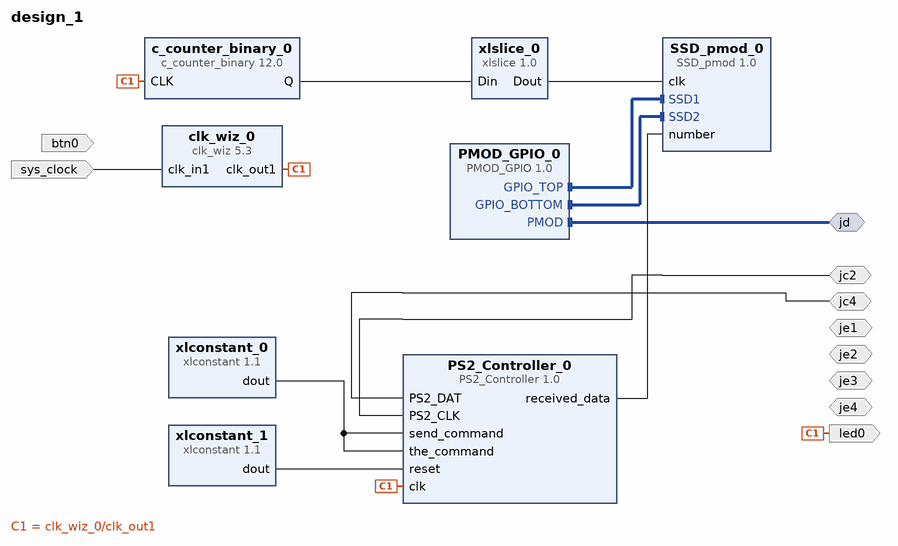
[diagram p0: block diagram of the top level]
# Vivado block design design_1, xc7z010clg400-1, Vivado 2016.4
create_bd_design design_1

create_bd_intf_port -mode Master -vlnv digilentinc.com:interface:pmod_rtl:1.0 jd
create_bd_port -dir IO je1
create_bd_port -dir IO je3
create_bd_port -dir I -type rst btn0
create_bd_port -dir IO je2
create_bd_port -dir IO je4
create_bd_port -dir I -type clk sys_clock
set_property -dict {CONFIG.FREQ_HZ 125000000 CONFIG.PHASE 0.000} [get_bd_ports sys_clock]
create_bd_port -dir O led0
create_bd_port -dir IO jc4
create_bd_port -dir IO jc2

create_bd_cell -type ip -vlnv xilinx.com:ip:clk_wiz:5.3 clk_wiz_0
set_property -dict [list \
  CONFIG.PRIMITIVE PLL \
  CONFIG.CLKOUT1_REQUESTED_OUT_FREQ 100.000 \
  CONFIG.CLKOUT1_DRIVES BUFG \
  CONFIG.CLKOUT2_DRIVES BUFG \
  CONFIG.CLKOUT3_DRIVES BUFG \
  CONFIG.CLKOUT4_DRIVES BUFG \
  CONFIG.CLKOUT5_DRIVES BUFG \
  CONFIG.CLKOUT6_DRIVES BUFG \
  CONFIG.CLKOUT7_DRIVES BUFG \
  CONFIG.FEEDBACK_SOURCE FDBK_AUTO \
  CONFIG.USE_RESET false \
  CONFIG.MMCM_DIVCLK_DIVIDE 5 \
  CONFIG.MMCM_CLKFBOUT_MULT_F 36 \
  CONFIG.MMCM_COMPENSATION ZHOLD \
  CONFIG.MMCM_CLKOUT0_DIVIDE_F 9 \
  CONFIG.USE_BOARD_FLOW true \
  CONFIG.CLK_IN1_BOARD_INTERFACE sys_clock \
  CONFIG.CLKOUT1_JITTER 237.312 \
  CONFIG.CLKOUT1_PHASE_ERROR 249.865 \
] [get_bd_cells clk_wiz_0]
create_bd_cell -type ip -vlnv skyroger2.com:user:PMOD_GPIO:1.0 PMOD_GPIO_0
create_bd_cell -type ip -vlnv xilinx.com:ip:xlconstant:1.1 xlconstant_0
set_property -dict {CONFIG.CONST_WIDTH 8 CONFIG.CONST_VAL 0} [get_bd_cells xlconstant_0]
create_bd_cell -type ip -vlnv skyroger2.com:user:SSD_pmod:1.0 SSD_pmod_0
create_bd_cell -type ip -vlnv xilinx.com:ip:c_counter_binary:12.0 c_counter_binary_0
set_property -dict {CONFIG.Output_Width 8} [get_bd_cells c_counter_binary_0]
create_bd_cell -type ip -vlnv xilinx.com:ip:xlslice:1.0 xlslice_0
set_property -dict {CONFIG.DOUT_WIDTH 1 CONFIG.DIN_TO 7 CONFIG.DIN_FROM 7 CONFIG.DIN_WIDTH 8} [get_bd_cells xlslice_0]
create_bd_cell -type ip -vlnv toronto.edu:user:PS2_Controller:1.0 PS2_Controller_0
set_property -dict {CONFIG.CLOCK 100} [get_bd_cells PS2_Controller_0]
create_bd_cell -type ip -vlnv xilinx.com:ip:xlconstant:1.1 xlconstant_1

# ---- connections ----

connect_bd_intf_net [get_bd_intf_pins SSD_pmod_0/SSD1] [get_bd_intf_pins PMOD_GPIO_0/GPIO_TOP]
connect_bd_intf_net [get_bd_intf_pins SSD_pmod_0/SSD2] [get_bd_intf_pins PMOD_GPIO_0/GPIO_BOTTOM]
connect_bd_intf_net [get_bd_intf_ports jd] [get_bd_intf_pins PMOD_GPIO_0/PMOD]
connect_bd_net [get_bd_ports sys_clock] [get_bd_pins clk_wiz_0/clk_in1]
connect_bd_net [get_bd_pins clk_wiz_0/clk_out1] [get_bd_ports led0] [get_bd_pins c_counter_binary_0/CLK] [get_bd_pins PS2_Controller_0/clk]
connect_bd_net [get_bd_pins xlconstant_0/dout] [get_bd_pins PS2_Controller_0/the_command] [get_bd_pins PS2_Controller_0/send_command]
connect_bd_net [get_bd_ports jc4] [get_bd_pins PS2_Controller_0/PS2_DAT]
connect_bd_net [get_bd_ports jc2] [get_bd_pins PS2_Controller_0/PS2_CLK]
connect_bd_net [get_bd_pins PS2_Controller_0/received_data] [get_bd_pins SSD_pmod_0/number]
connect_bd_net [get_bd_pins c_counter_binary_0/Q] [get_bd_pins xlslice_0/Din]
connect_bd_net [get_bd_pins xlslice_0/Dout] [get_bd_pins SSD_pmod_0/clk]
connect_bd_net [get_bd_pins xlconstant_1/dout] [get_bd_pins PS2_Controller_0/reset]

validate_bd_design
save_bd_design
